# EAGLE schematic max1626 (EAGLE 9.2.2)
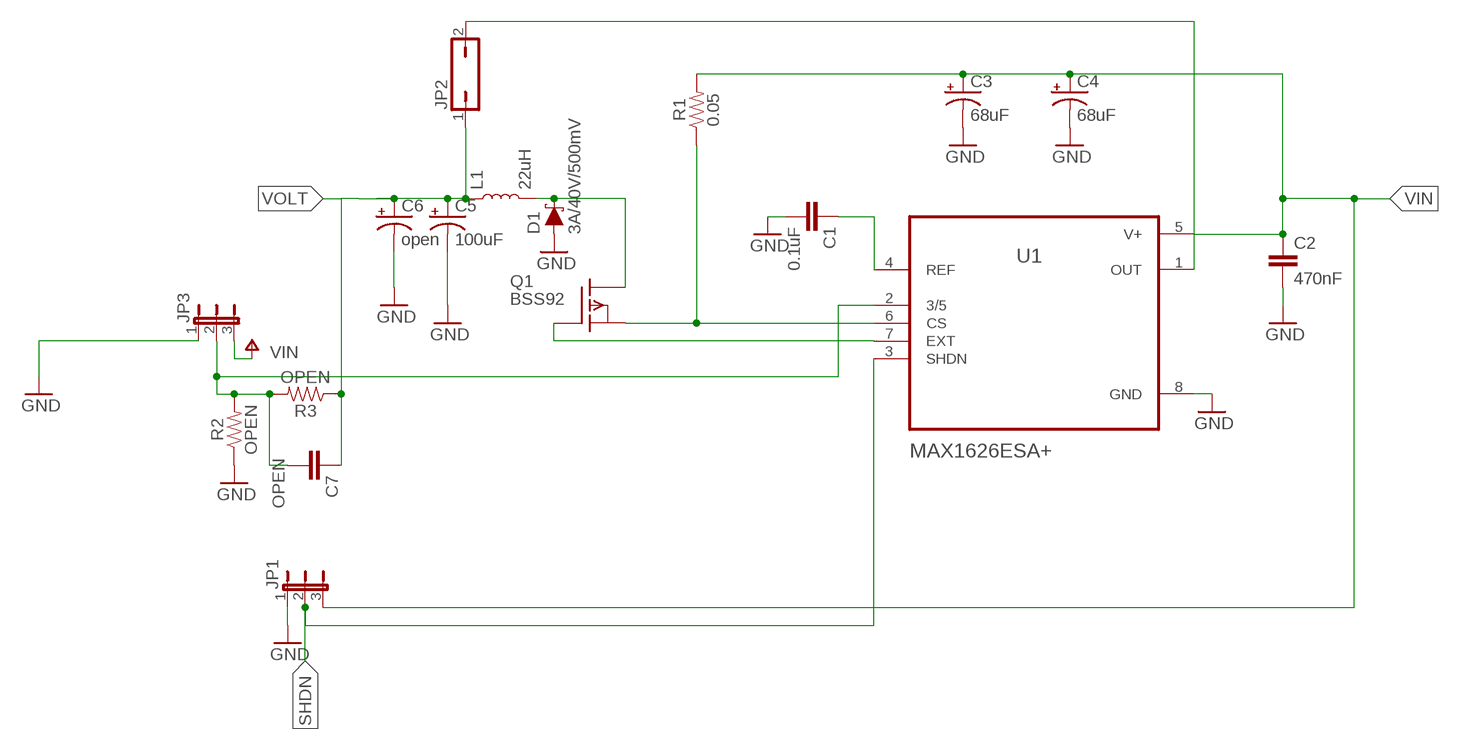
[diagram p0: schematic, sheet 1]

## Parts
C1  0.1uF  0.1UF-0603-25V-(+80/-20%)  [0603]
C2  470nF  470NF-0603-10V-10%-X5R  [0603]
C3  68uF  68UF-POLAR-EIA3528-10V-10%(TANT)  [EIA3528]
C4  68uF  68UF-POLAR-EIA3528-10V-10%(TANT)  [EIA3528]
C5  100uF  100UF-POLAR-10X10.5-63V-20%  [NIC_10X10.5_CAP]
C6  open  100UF-POLAR-10X10.5-63V-20%  [NIC_10X10.5_CAP]
C7  OPEN  0.1UF-0603-25V-(+80/-20%)  [0603]
D1  3A/40V/500mV  DIODE-SCHOTTKY-B340A  [SMA-DIODE]
JP1  JP2W  [JP2W]
JP2  JP1Q  [JP1]
JP3  JP2W  [JP2W]
L1  22uH  INDUCTOR  [XFL4020]
Q1  BSS92  [TO92]
R1  0.05  0.05OHM-0603-1/5W-1%  [0603]
R2  OPEN  0.05OHM-0603-1/5W-1%  [0603]
R3  OPEN  0.05OHM-0603-1/5W-1%  [0603]
U1  MAX1626ESA+  [SOIC127P600X175-8N]

## Nets
GND: C1.2 C2.2 C3.C(-) C4.C(-) C5.- C6.- D1.A JP1.1 JP3.1 R2.1 U1.8(GND)
N$1: C1.1 U1.4(REF)
N$5: Q1.1(G) U1.7(EXT)
N$6: Q1.3(S) R1.1 U1.6(CS)
N$7: D1.C L1.P$2 Q1.2(D)
N$10: C7.2 JP3.2 R2.2 R3.2 U1.2(3/5)
N$11: JP2.2 U1.1(OUT)
SHDN: JP1.2 U1.3(SHDN)
VIN: C2.1 C3.A(+) C4.A(+) JP1.3 JP3.3 R1.2 U1.5(V+) ; supply symbol labelled V+
VOLT: C5.+ C6.+ C7.1 JP2.1 L1.P$1 R3.1

## Library data of the parts
C1 = SparkFun-Capacitors:0.1UF: 0.1µF ceramic capacitors A capacitor is a passive two-terminal electrical component used to store electrical energy temporarily in an electric field.; PROD_ID: CAP-00810
C2 = SparkFun-Capacitors:470NF: 0.47uF/470nF ceramic capacitors A capacitor is a passive two-terminal electrical component used to store electrical energy temporarily in an electric field.; PROD_ID: CAP-13216
C3 C4 = SparkFun-Capacitors:68UF-POLAR: 68µF polarized capacitors A capacitor is a passive two-terminal electrical component used to store electrical energy temporarily in an electric field.; PROD_ID: CAP-10790
C5 = SparkFun-Capacitors:100UF-POLAR: 100µF polarized capacitors A capacitor is a passive two-terminal electrical component used to store electrical energy temporarily in an electric field.; PROD_ID: CAP-08362
C6 = SparkFun-Capacitors:100UF-POLAR: 100µF polarized capacitors A capacitor is a passive two-terminal electrical component used to store electrical energy temporarily in an electric field.; PROD_ID: CAP-08362; VALUE: 100uF
C7 = SparkFun-Capacitors:0.1UF: 0.1µF ceramic capacitors A capacitor is a passive two-terminal electrical component used to store electrical energy temporarily in an electric field.; PROD_ID: CAP-00810; VALUE: 0.1uF
D1 = SparkFun-DiscreteSemi:DIODE-SCHOTTKY: Schottky diode A Schottky diode is a semiconductor diode which has a low forward voltage drop and a very fast switching action.; PROD_ID: DIO-09886
JP1 JP3 = jumper:JP2W: JUMPER
JP2 = jumper:JP1Q: JUMPER
L1 = SparkFun-Coils:INDUCTOR: Inductors Resist changes in electrical current. Basically a coil of wire. SparkFun Products: SparkFun Load Cell Amplifier - HX711 <https://www.sparkfun.com/products/13879> IOIO-OTG - V2.2 <https://www.sparkfun.com/products/13613>
Q1 = transistor-fet:BSS92: P-Channel Enhancement MOSFET -200V; -0,15A; 11Ohm
R1 = SparkFun-Resistors:0.05OHM: 0.05Ω resistor A resistor is a passive two-terminal electrical component that implements electrical resistance as a circuit element. Resistors act to reduce current flow, and, at the same time, act to lower voltage levels within circuits. - Wikipedia; PROD_ID: RES-12535
R2 R3 = SparkFun-Resistors:0.05OHM: 0.05Ω resistor A resistor is a passive two-terminal electrical component that implements electrical resistance as a circuit element. Resistors act to reduce current flow, and, at the same time, act to lower voltage levels within circuits. - Wikipedia; PROD_ID: RES-12535; VALUE: 0.05
U1 = MAX1626ESA_ (9):MAX1626ESA+: None; AVAILABILITY: Unavailable; DESCRIPTION: 5V/3.3V or Adjustable, 100% Duty Cycle, High-Efficiency, Step-Down DC-DC Control; MF: Maxim Integrated; MP: MAX1626ESA+; PACKAGE: SOIC-8 Maxim Integrated; PRICE: None